# Altium schematic sheet PTC08_RS232Shifter.SchDoc
size A
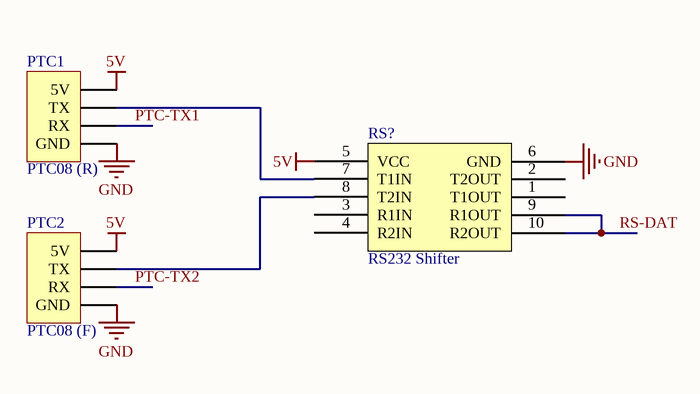
[diagram p0: PTC08_RS232Shifter.SchDoc]

## Parts
PTC1  PTC08 (R)  [HDR1X4]
PTC2  PTC08 (F)  [HDR1X4]
RS?  RS232 Shifter

## Nets
5V: PTC1.1(5V) PTC2.1(5V) RS?.5(VCC)
GND: PTC1.4(GND) PTC2.4(GND) RS?.6(GND)
PTC-TX1: PTC1.3(RX)
PTC-TX2: PTC2.3(RX)
RS-DAT: RS?.9(R1OUT) RS?.10(R2OUT)
NetPTC1_2: PTC1.2(TX) RS?.7(T1IN)
NetPTC2_2: PTC2.2(TX) RS?.8(T2IN)

Not connected (* = marked no-connect by the designer): RS? 1(T1OUT) 2(T2OUT) 3(R1IN) 4(R2IN)

## Library data of the parts
PTC1 PTC2 = Header 4: Header, 4-Pin; LatestRevisionDate: 17-Jul-2002; LatestRevisionNote: Re-released for DXP Platform.; Publisher: Altium Limited
RS? = Component_1